# Altium schematic sheet LoRa.SchDoc
size A4; SheetNumber: 4; SheetTotal: 7
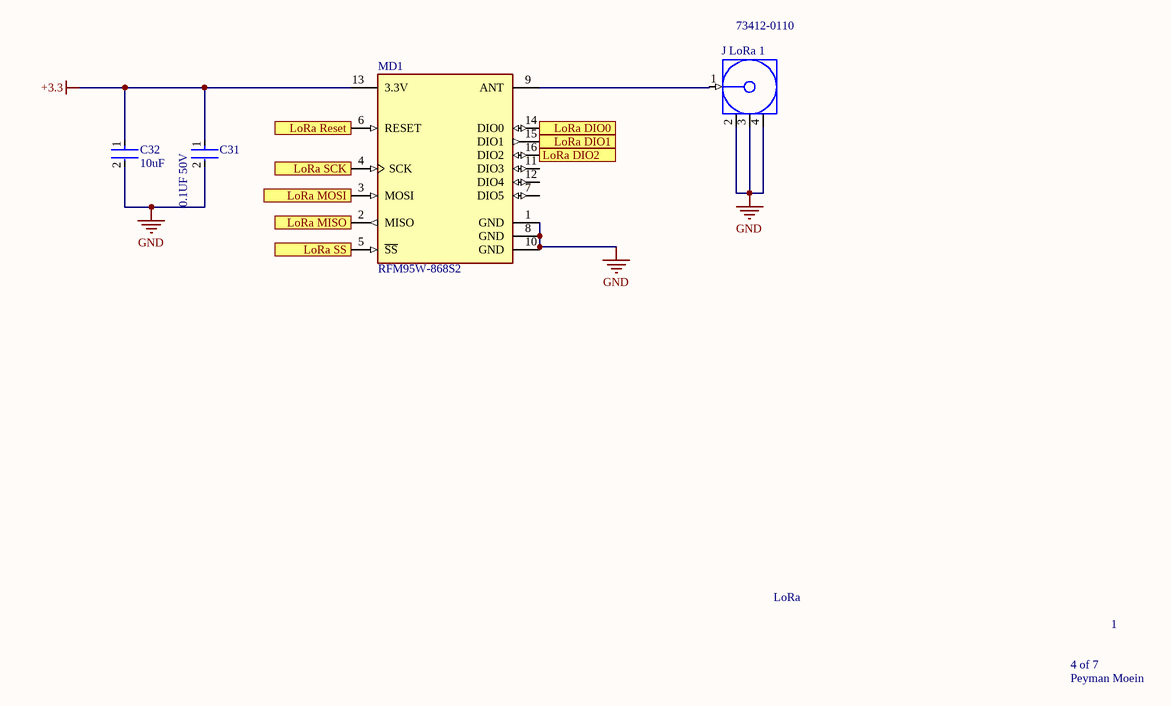
[diagram p0: LoRa.SchDoc]

## Parts
C31  0.1UF 50V  [FP-CC0805-0_85-MFG]
C32  10uF  [FP-GRM21B-0_1-IPC_C]
J_LoRa_1  73412-0110  [MOLX-73412-0110_V]
MD1  RFM95W-868S2  [FP-RFM95W-868S2-MFG]

## Ports
LoRa DIO0 (in), LoRa DIO1 (in), LoRa DIO2 (in), LoRa MISO (in), LoRa MOSI (out), LoRa Reset (in), LoRa SCK (in), LoRa SS (in)

## Nets
+3.3: C31.1 C32.1 MD1.13(3.3V)
GND: C31.2 C32.2 J_LoRa_1.2(GND) J_LoRa_1.3(GND) J_LoRa_1.4(GND) MD1.1(GND) MD1.8(GND) MD1.10(GND)
LoRa DIO0: MD1.14(DIO0) ; port LoRa DIO0
LoRa DIO1: MD1.15(DIO1) ; port LoRa DIO1
LoRa DIO2: MD1.16(DIO2) ; port LoRa DIO2
LoRa MISO: MD1.2(MISO) ; port LoRa MISO
LoRa MOSI: MD1.3(MOSI) ; port LoRa MOSI
LoRa Reset: MD1.6(RESET) ; port LoRa Reset
LoRa SCK: MD1.4(SCK) ; port LoRa SCK
LoRa SS: MD1.5(~{SS}) ; port LoRa SS
NetJ_LoRa_1_1: J_LoRa_1.1(SIGNAL) MD1.9(ANT)

Not connected (* = marked no-connect by the designer): MD1 7(DIO5) 11(DIO3) 12(DIO4)

## Notes on the sheet
- LoRa
- 4 of 7
- 1
- Peyman Moein

## Library data of the parts
C31 = CMP-2100-03606-3: C49678; Manufacturer Part Number: CC0805KRX7R9BB104; Manufacturer: Yageo; Tolerance: 0.1; Capacitance: 100 nF; Value: 100 nF; Temperature Characteristic: X7R; Material: Ceramic; Device Class L1: Passive Components; ComponentLink2Description: Datasheet; Package: CC0805-0.85; Digikey Description: CAP CER 0.1UF 50V X7R 0805; Device Class L3: Ceramic Capacitors; Temperature: -30°C to +85°C; Voltage Rating: 50 V; Height: 0.95mm; RoHS: TRUE; Ipc Land Pattern Name: CAPC200125X85; Device Class L2: Capacitors; Category: Cap; Temperature Range Low: -30°C; Temperature Range High: +85°C; Mouser Description: Multilayer Ceramic Capacitors MLCC - SMD/SMT 100nF 50V X7R 10%; Footprint Url: http://www.yageo.com/exep/pages/download/literatures/UPY-C_GEN_24.pdf; Automotive: No; Octopart: https://octopart.com/cc0805krx7r9bb104-yageo-192993; Lead Free: Yes; ComponentLink2URL: http://www.yageo.com/documents/recent/UPY-GPHC_Y5V_6.3V-to-50V_8.pdf
C32 = CMP-2007-03453-2: C77075; Voltage Rating (DC): 16V; Dielectric: X5R; Tolerance: 10%; Material: Ceramic; Radiation Hardening: No; Thickness: 0.053inch; Lead Free: Lead Free; Package Quantity: 1; Width: 1.25mm; Case Code (Imperial): 0805; Depth: 1.25mm; Packaging: Tape and Reel; Max Operating Temperature: 85°C; Voltage Rating: 16V; Voltage: 16V; Capacitance: 10uF; Height: 1.25mm; Case Code (Metric): 2012; Mount: Surface Mount; Case/Package: 0805; REACH SVHC: No SVHC; Length: 2mm; Min Operating Temperature: -55°C; Termination: SMD/SMT
J_LoRa_1 = CMP-1676-00003-1: C411563; Voltage Rating (AC): 60 V; Mating Cycles: 30; Impedance: 50 Ohm; Frequency: 6 Hz; Gender: Female; RoHSCompliant: true; Length: 3 mm; DatasheetVersion: 04/2016; ComponentLink3URL: http://www.molex.com/pdm_docs/sd/734120110_sd.pdf; Max Operating Temperature: 90 degC; Contact Material: Bronze; Mount: Surface Mount; ComponentLink2Description: Datasheet; Packaging: Tape and Reel; Radiation Hardening: No; Voltage Rating: 60 V; Mounting Technology: Surface Mount; ComponentLink1Description: Manufacturer URL; ComponentLink1URL: http://www.molex.com/; Width: 3 mm; ComponentLink3Description: Package Specification; Package Quantity: 5000; PackageReference: 73412-0110; Min Operating Temperature: -40 degC; Height: 1.25 mm; REACH SVHC: Unknown; ComponentLink2URL: http://www.molex.com/webdocs/datasheets/pdf/en-us/0734120110_RF_COAX_CONNECTORS.pdf; Contact Plating: Gold; PackageDescription: 4-Leads SMD, Body 2.6 x 2.6 mm; PackageVersion: Rev. C14, 07/2015
MD1 = CMP-204316-000001-1: C2844472; Data Rate: 300Kbps; Frequency: 868MHz; Sensitivity: -123dBm; Interface: SPI; Current - Transmitting: 120mA; Current - Receiving: 12.1mA; Max Operating Temperature: 70°C; Case/Package: SMD/SMT; Packaging: Bulk; Mount: Surface Mount; Min Operating Temperature: -20°C